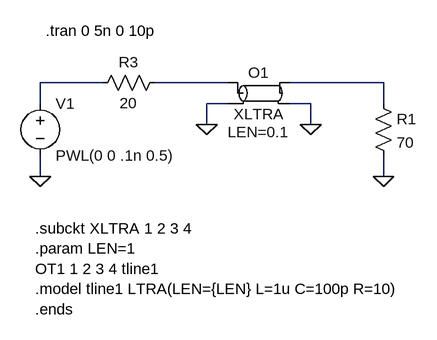
[diagram p0: schematic lossy_line_with_param.asc]
lossy_line_with_param.asc, the LTspice schematic file:
Version 4
SHEET 1 908 680
WIRE 16 112 -80 112
WIRE 208 112 96 112
WIRE 448 112 304 112
WIRE -80 144 -80 112
WIRE 208 144 176 144
WIRE 336 144 304 144
WIRE 448 144 448 112
WIRE 176 176 176 144
WIRE 336 176 336 144
WIRE -80 256 -80 224
WIRE 448 256 448 224
FLAG -80 256 0
FLAG 176 176 0
FLAG 336 176 0
FLAG 448 256 0
SYMBOL res 432 128 R0
SYMATTR InstName R1
SYMATTR Value 70
SYMBOL voltage -80 128 R0
WINDOW 123 0 0 Left 0
WINDOW 39 0 0 Left 0
SYMATTR InstName V1
SYMATTR Value PWL(0 0 .1n 0.5)
SYMBOL res 0 128 R270
WINDOW 0 32 56 VTop 0
WINDOW 3 0 56 VBottom 0
SYMATTR InstName R3
SYMATTR Value 20
SYMBOL ltline 256 128 R0
WINDOW 39 0 60 Center 0
SYMATTR SpiceLine LEN=0.1
SYMATTR InstName O1
SYMATTR Value XLTRA
SYMATTR Prefix X
TEXT -72 32 Left 0 !.tran 0 5n 0 10p
TEXT -88 336 Left 0 !.subckt XLTRA 1 2 3 4 \n.param LEN=1\nOT1 1 2 3 4 tline1\n.model tline1 LTRA(LEN={LEN} L=1u C=100p R=10)\n.ends

The netlist it stands for:
* lossy_line_with_param.asc
R1 N003 0 70
V1 N001 0 PWL(0 0 .1n 0.5)
R3 N001 N002 20
XO1 N002 0 N003 0 XLTRA LEN=0.1  ; pins I1 R1 I2 R2
.tran 0 5n 0 10p
.subckt XLTRA 1 2 3 4
.param LEN=1
OT1 1 2 3 4 tline1
.model tline1 LTRA(LEN={LEN} L=1u C=100p R=10)
.ends
.backanno
.end